# EAGLE design intervalometer (EAGLE 5.09)
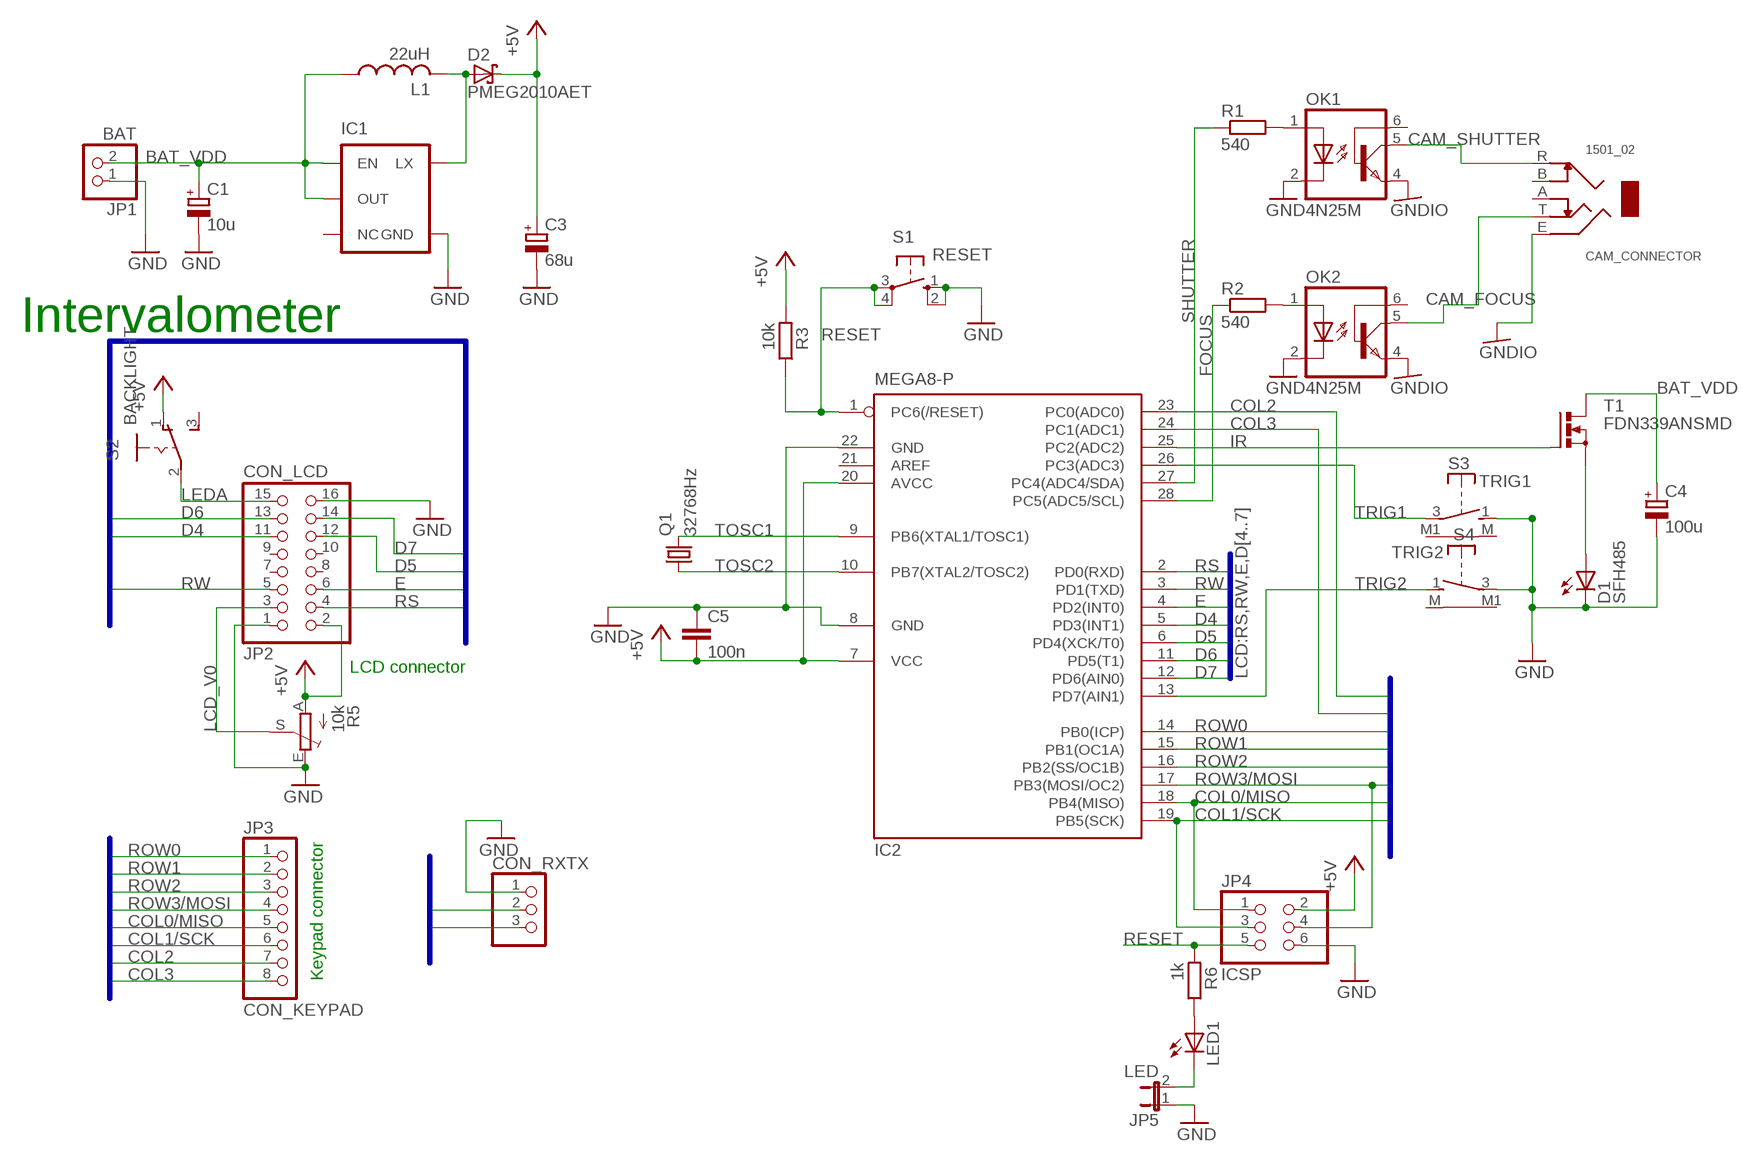
[diagram p0: schematic, sheet 1]

## Parts
C1  10u  CPOL-EUE2-5  [E2-5]
C3  68u  CPOL-EUE2-5  [E2-5]
C4  100u  CPOL-EUE2-5  [E2-5]
C5  100n  C-EU050-024X044  [C050-024X044]
CAM_CONNECTOR  1501_02  [1501_02]
CON_RXTX  PINHD-1X3  [1X03]
D1  SFH485  SFH482  [SFH482]
D2  PMEG2010AET  BAS40  [SOT23]
IC1  V_REG_NCP1400SOT23-5  [SOT23-5]
IC2  MEGA8-P  [DIL28-3]
JP1  BAT  PINHD-1X2  [1X02]
JP2  CON_LCD  PINHD-2X8  [2X08]
JP3  CON_KEYPAD  PINHD-1X8  [1X08]
JP4  ICSP  PINHD-2X3  [2X03]
JP5  LED  JP1E  [JP1]
L1  22uH  L-USL4035M  [L4035M]
LED1  LED3MM  [LED3MM]
OK1  4N25M  [DIL06]
OK2  4N25M  [DIL06]
Q1  32768Hz  CRYSTALTC26V  [TC26V]
R1  540  R-EU_0207/10  [0207/10]
R2  540  R-EU_0207/10  [0207/10]
R3  10k  R-EU_0207/10  [0207/10]
R5  10k  TRIM_EU-B25P  [B25P]
R6  1k  R-EU_0207/10  [0207/10]
S1  RESET  10-XX  [B3F-10XX]
S2  BACKLIGHT  255SB  [255SB]
S3  TRIG1  TP33W  [TP33W]
S4  TRIG2  TP33W  [TP33W]
T1  FDN339ANSMD  [SUPERSOT-3]

## Nets
+5V [power]: C3.+ C5.2 D2.3(C) IC2.7(VCC) IC2.20(AVCC) JP2.2 JP4.2 R3.2 R5.A S2.1(O)
BAT_VDD [power]: C1.+ C4.+ IC1.1(EN) IC1.2(OUT) JP1.2 L1.1 T1.D
CAM_FOCUS: CAM_CONNECTOR.T OK2.5(COL)
CAM_SHUTTER: CAM_CONNECTOR.R OK1.5(COL)
COL0/MISO: IC2.18(PB4(MISO)) JP3.5 JP4.1
COL1/SCK: IC2.19(PB5(SCK)) JP3.6 JP4.3
COL2: IC2.23(PC0(ADC0)) JP3.7
COL3: IC2.24(PC1(ADC1)) JP3.8
D4: IC2.5(PD3(INT1)) JP2.11
D5: IC2.6(PD4(XCK/T0)) JP2.12
D6: IC2.11(PD5(T1)) JP2.13
D7: IC2.12(PD6(AIN0)) JP2.14
E: IC2.4(PD2(INT0)) JP2.6
FOCUS: IC2.28(PC5(ADC5/SCL)) R2.1
GND [gnd]: C1.- C3.- C4.- C5.1 CON_RXTX.1 D1.K(C) IC2.8(GND) IC2.22(GND) JP1.1 JP2.1 JP2.16 JP4.6 JP5.1 OK1.2(C) OK2.2(C) R5.E S1.1(S) S1.2(S1) S3.1(S) S4.3(P)
GNDIO: CAM_CONNECTOR.E OK1.4(EMI) OK2.4(EMI)
IR: IC2.25(PC2(ADC2)) T1.G
LCD_V0: JP2.3 R5.S
LEDA: JP2.15 S2.2(P)
N$1: JP5.2 LED1.K(C)
N$2: LED1.A R6.1
N$3: OK1.1(A) R1.2
N$4: OK2.1(A) R2.2
N$7: D1.A T1.S
N$32: D2.1(A) IC1.5(LX) L1.2
RESET: IC2.1(PC6(/RESET)) JP4.5 R3.1 R6.2 S1.3(P) S1.4(P1)
ROW0: IC2.14(PB0(ICP)) JP3.1
ROW1: IC2.15(PB1(OC1A)) JP3.2
ROW2: IC2.16(PB2(SS/OC1B)) JP3.3
ROW3/MOSI: IC2.17(PB3(MOSI/OC2)) JP3.4 JP4.4
RS: CON_RXTX.2 IC2.2(PD0(RXD)) JP2.4
RW: CON_RXTX.3 IC2.3(PD1(TXD)) JP2.5
SHUTTER: IC2.27(PC4(ADC4/SDA)) R1.1
TOSC1: IC2.9(PB6(XTAL1/TOSC1)) Q1.2
TOSC2: IC2.10(PB7(XTAL2/TOSC2)) Q1.1
TRIG1: IC2.26(PC3(ADC3)) S3.3(P)
TRIG2: IC2.13(PD7(AIN1)) S4.1(S)
Unconnected: CAM_CONNECTOR.A CAM_CONNECTOR.B IC1.3(NC) IC1.4(GND) IC2.21(AREF) JP2.7 JP2.8 JP2.9 JP2.10 OK1.6(BAS) OK2.6(BAS) S2.3(S) S3.M S3.M1(M) S4.M S4.M1(M)

## Buses
LCD:RS,RW,E,D[4..7]
KEYPAD:ROW[0..2],ROW3/MOSI,COL0/MISO,COL1/SCK,COL2,COL3

## Notes on the sheet
- Intervalometer
- LCD connector
- Keypad connector

## Library data of the parts
C1 C3 C4 = rcl:CPOL-EU: POLARIZED CAPACITOR, European symbol
C5 = rcl:C-EU: CAPACITOR, European symbol
CAM_CONNECTOR = DIY:1501_02: Lumber 1501_02 SMT mountebalre stereo 2.5mm jack connector with two breaks
CON_RXTX = pinhead:PINHD-1X3: PIN HEADER
D1 = led:SFH482: IR LED infrared emitting diode, Infineon
D2 = diode:BAS40: Silicon Schottky Diodes General-purpose diode for high-speed switching
IC1 = SparkFun:V_REG_NCP1400: Switching step-up voltage regulator NCP1400 switiching regulator takes single cell AA and outputs 100mA at 3.3V or 5V with minimal number of external components.
IC2 = atmel:MEGA8-P: MICROCONTROLLER 8 Kbytes FLASH, 1 kbytes SRAM, 512 bytes EEPROM, USART, 4-channel 10 bit ADC, 2-channel 8 bit ADC Pin compatible with Atmega48, ATMega88, ATMega168 Source: avr.lbr
JP1 = pinhead:PINHD-1X2: PIN HEADER
JP2 = pinhead:PINHD-2X8: PIN HEADER
JP3 = pinhead:PINHD-1X8: PIN HEADER
JP4 = pinhead:PINHD-2X3: PIN HEADER
JP5 = jumper:JP1E: JUMPER
L1 = rcl:L-US: INDUCTOR, American symbol
LED1 = led:LED: LED OSRAM: - CHIPLED LG R971, LG N971, LY N971, LG Q971, LY Q971, LO R971, LY R971 LH N974, LH R974 LS Q976, LO Q976, LY Q976 LO Q996 - Hyper CHIPLED LW Q18S LB Q993, LB Q99A, LB R99A - SideLED LS A670, LO A670, LY A670, LG A670, LP A670 LB A673, LV A673, LT A673, LW A673 LH A674 LY A675 LS A676, LA A676, LO A676, LY A676, LW A676 LS A679, LY A679, LG A679 - Hyper Micro SIDELED® LS Y876, LA Y876, LO Y876, LY Y876 LT Y87S - SmartLED LW L88C, LW L88S LB L89C, LB L89S, LG L890 LS L89K, LO L89K, LY L89K LS L896, LA L896, LO L896, LY L896 - TOPLED LS T670, LO T670, LY T670, LG T670, LP T670 LSG T670, LSP T670, LSY T670, LOP T670, LYG T670 LG T671, LOG T671, LSG T671 LB T673, LV T673, LT T673, LW T673 LH T674 LS T676, LA T676, LO T676, LY T676, LB T676, LH T676, LSB T676, LW T676 LB T67C, LV T67C, LT T67C, LS T67K, LO T67K, LY T67K, LW E67C LS E67B, LA E67B, LO E67B, LY E67B, LB E67C, LV E67C, LT E67C LW T67C LS T679, LY T679, LG T679 LS T770, LO T770, LY T770, LG T770, LP T770 LB T773, LV T773, LT T773, LW T773 LH T774 LS E675, LA E675, LY E675, LS T675 LS T776, LA T776, LO T776, LY T776, LB T776 LHGB T686 LT T68C, LB T68C - Hyper Mini TOPLED® LB M676 - Mini TOPLED Santana® LG M470 LS M47K, LO M47K, LY M47K Source: http://www.osram.convergy.de LUXEON: - LUMILED® LXK2-PW12-R00, LXK2-PW12-S00, LXK2-PW14-U00, LXK2-PW14-V00 LXK2-PM12-R00, LXK2-PM12-S00, LXK2-PM14-U00 LXK2-PE12-Q00, LXK2-PE12-R00, LXK2-PE12-S00, LXK2-PE14-T00, LXK2-PE14-U00 LXK2-PB12-K00, LXK2-PB12-L00, LXK2-PB12-M00, LXK2-PB14-N00, LXK2-PB14-P00, LXK2-PB14-Q00 LXK2-PR12-L00, LXK2-PR12-M00, LXK2-PR14-Q00, LXK2-PR14-R00 LXK2-PD12-Q00, LXK2-PD12-R00, LXK2-PD12-S00 LXK2-PH12-R00, LXK2-PH12-S00 LXK2-PL12-P00, LXK2-PL12-Q00, LXK2-PL12-R00 Source: www.luxeon.com KINGBRIGHT: KA-3528ASYC Source: www.kingbright.com
OK1 OK2 = optocoupler:4N*?M: General Purpose 6-Pin Phototransistor Optocouplers Source: http://www.fairchildsemi.com/ds/4N/4N35-M.pdf
Q1 = crystal:CRYSTAL: CRYSTAL
R1-R3 R6 = rcl:R-EU_: RESISTOR, European symbol
R5 = pot:TRIM_EU-: POTENTIOMETER
S1 = switch-omron:10-XX: OMRON SWITCH
S2 = switch:255SB: SLIDING SWITCH Distributor Buerklin, 11G810
S3 S4 = switch-misc:TP33W: SWITCH
T1 = DIY:FDN339AN: N-Channel 2.5V Specified PowerTrench? MOSFET

## Net classes
0 default: width 0.254 mm, drill 0.305 mm, clearance 0.152 mm
1 power: width 0.61 mm, drill 0.508 mm, clearance 0.152 mm
2 gnd: width 0.305 mm, drill 0.508 mm, clearance 0.152 mm
3 usbvcc: width 0.508 mm, drill 0.508 mm, clearance 0.152 mm
4 aref: width 0.406 mm

## Board
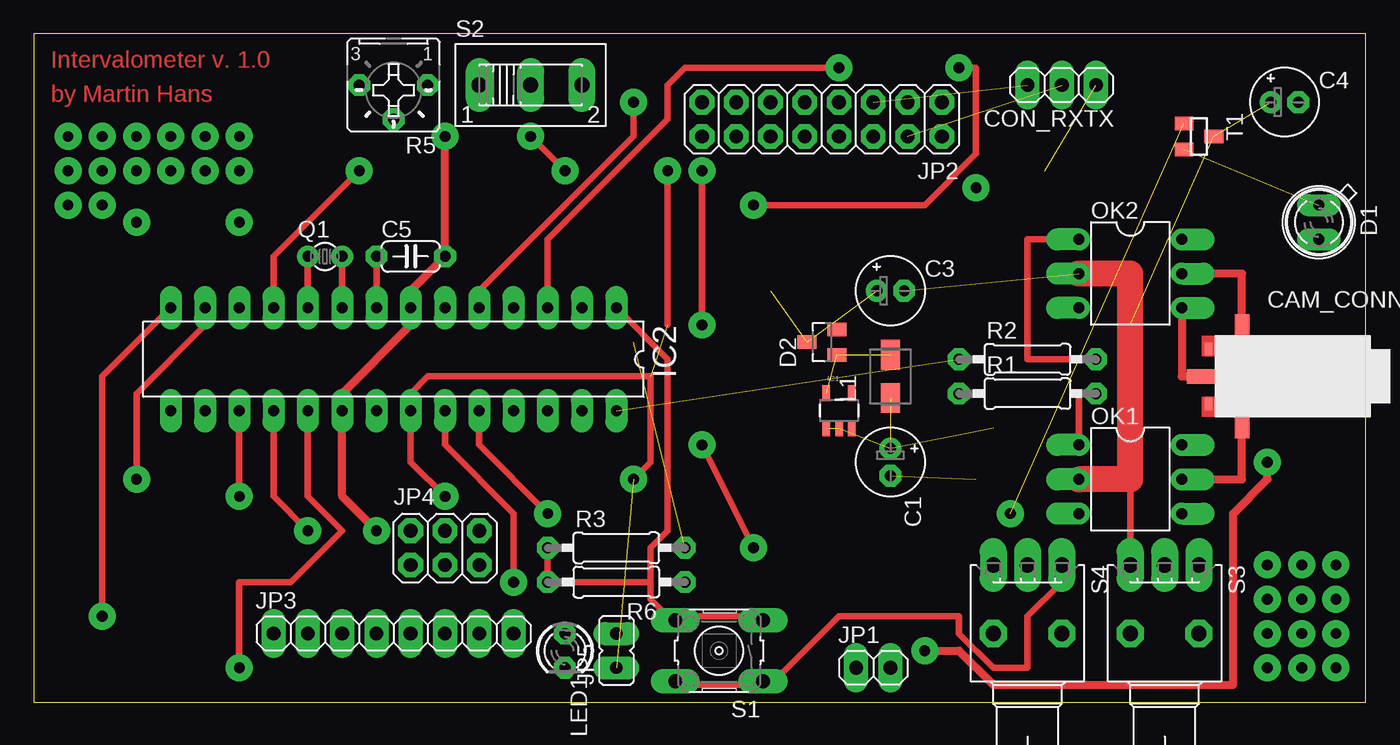
[diagram p1: board, top side]
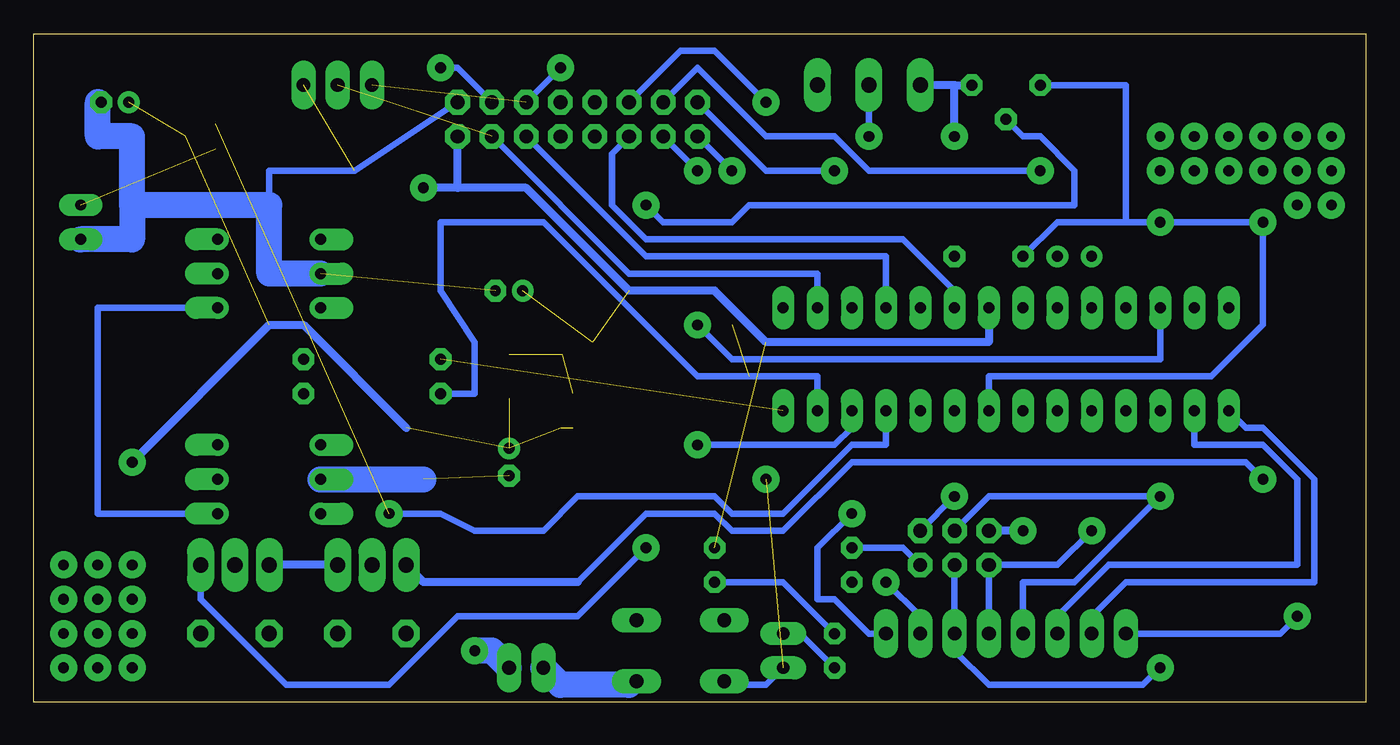
[diagram p2: board, bottom side, seen from below]

Size 98.73 x 49.52 mm. Coordinates in mm from the lower left corner, seen from the top.
Outline: 0,0 98.73,0 98.73,49.52 0,49.52 0,0
Copper layers (1*16): Top 0.035mm / dielectric 1.5mm / Bottom 0.035mm
Design rules "hobby *": minimum track width 0.5mm, minimum drill 0.8mm, track to track 0.3mm, track to pad 0.5mm, pad to pad 0.4mm, via to via 0.5mm, smd to smd 8mil, copper to edge 10mil, drill to drill 8mil, minimum pad ring 0.4mm, minimum via ring 0.6mm, stop-mask expansion 0mil, vias tented up to drill 0mil, thermal gap 10mil
tRestrict: area 41.9,1.3 to 44.5,6.3; area 59.7,1.3 to 64.8,3.8; area 16.5,3.8 to 36.8,6.3; area 48.3,40.6 to 68.6,45.7; area 92.7,33 to 97.8,38.1; area 26.7,8.9 to 34.3,14; area 38.1,1.3 to 40.6,6.3; area 31.8,43.2 to 41.9,48.3; area 22.9,43.2 to 30.5,49.5; area 61,14 to 66,16.5; area 90.2,43.2 to 95.2,45.7
vRestrict: area 7.6,22.9 to 45.7,27.9; area 39.4,10.2 to 47,12.7; area 39.4,7.6 to 47,10.2; area 69.8,24.1 to 77.5,26.7; area 69.8,21.6 to 77.5,24.1; area 78.7,27.9 to 83.8,35.6; area 78.7,12.7 to 83.8,20.3; area 69.8,1.3 to 87.6,8.9; area 87.6,21.6 to 99.1,26.7

### Footprints (pad centres in the part's own frame; a part is rotated, then mirrored left to right if it is on the bottom)
E2-5 = drill 0.813 pad 1.27 round: + -1.016,0 | drill 0.813 pad 1.27 octagon: - 1.016,0
C050-024X044 = drill 0.813 octagon: 1 -2.54,0; 2 2.54,0
1501_02 = smd 1.016 x 0.508: A -2,-12; B 2,-12 | smd 1.067 x 2.184: E 0,-12.5 | smd 2.184 x 1.067: R 3.5,-9.5; T -3.5,-9.5
1X03 = drill 1.016 long: 1 -2.54,0; 2 0,0; 3 2.54,0
SFH482 = drill 0.813 long: A -1.27,0; K 1.27,0
SOT23 = smd 1 x 1.4: 1 -0.95,-1.1; 2 0.95,-1.1; 3 0,1.1
SOT23-5 = smd 0.55 x 1.2: 1 -0.95,-1.3; 2 0,-1.3; 3 0.95,-1.3; 4 0.95,1.3; 5 -0.95,1.3
DIL28-3 = drill 0.813 long: 1 -16.51,-3.81; 2 -13.97,-3.81; 3 -11.43,-3.81; 4 -8.89,-3.81; 5 -6.35,-3.81; 6 -3.81,-3.81; 7 -1.27,-3.81; 8 1.27,-3.81; 9 3.81,-3.81; 10 6.35,-3.81; 11 8.89,-3.81; 12 11.43,-3.81; 13 13.97,-3.81; 14 16.51,-3.81; 15 16.51,3.81; 16 13.97,3.81; 17 11.43,3.81; 18 8.89,3.81; 19 6.35,3.81; 20 3.81,3.81; 21 1.27,3.81; 22 -1.27,3.81; 23 -3.81,3.81; 24 -6.35,3.81; 25 -8.89,3.81; 26 -11.43,3.81; 27 -13.97,3.81; 28 -16.51,3.81
1X02 = drill 1.016 long: 1 -1.27,0; 2 1.27,0
2X08 = drill 1.016 octagon: 1 -8.89,-1.27; 2 -8.89,1.27; 3 -6.35,-1.27; 4 -6.35,1.27; 5 -3.81,-1.27; 6 -3.81,1.27; 7 -1.27,-1.27; 8 -1.27,1.27; 9 1.27,-1.27; 10 1.27,1.27; 11 3.81,-1.27; 12 3.81,1.27; 13 6.35,-1.27; 14 6.35,1.27; 15 8.89,-1.27; 16 8.89,1.27
1X08 = drill 1.016 long: 1 -8.89,0; 2 -6.35,0; 3 -3.81,0; 4 -1.27,0; 5 1.27,0; 6 3.81,0; 7 6.35,0; 8 8.89,0
2X03 = drill 1.016 octagon: 1 -2.54,-1.27; 2 -2.54,1.27; 3 0,-1.27; 4 0,1.27; 5 2.54,-1.27; 6 2.54,1.27
JP1 = drill 0.914 long: 1 0,-1.27; 2 0,1.27
L4035M = smd 2.2 x 1.4: 1 -1.6,0; 2 1.6,0
LED3MM = drill 0.813 octagon: A -1.27,0; K 1.27,0
DIL06 = drill 0.813 offset: 1 -2.54,-3.81; 2 0,-3.81; 3 2.54,-3.81; 4 2.54,3.81; 5 0,3.81; 6 -2.54,3.81
TC26V = drill 0.813 round: 1 -1.27,0; 2 1.27,0
0207/10 = drill 0.813 octagon: 1 -5.08,0; 2 5.08,0
B25P = drill 0.813 octagon: A -2.54,0; E 2.54,0; S 0,2.54
B3F-10XX = drill 1.016 long: 1 -3.251,2.261; 2 3.251,2.261; 3 -3.251,-2.261; 4 3.251,-2.261
255SB = drill 1.118 long: 1 -3.81,0; 2 0,0; 3 3.81,0
TP33W = drill 1.118 long: 1 2.54,-5.08; 2 0,-5.08; 3 -2.54,-5.08 | drill 1.118 octagon: M 2.54,0; M1 -2.54,0
SUPERSOT-3 = smd 1 x 1.4: D 0,1.1; G -0.95,-1.1; S 0.95,-1.1

### Placement (x,y rotation side)
C1  63.5,17.78 270 top
C3  63.5,30.48 0 top
C4  92.71,44.45 0 top
C5  27.94,33.02 0 top
CAM_CONNECTOR  99.06,24.13 270 top
CON_RXTX  76.2,45.72 180 top
D1  95.25,35.56 270 top
D2  58.42,26.67 90 top
IC1  59.69,21.59 0 top
IC2  26.67,25.4 180 top
JP1  62.23,2.54 0 top
JP2  58.42,43.18 180 top
JP3  26.67,5.08 0 top
JP4  30.48,11.43 0 top
JP5  43.18,3.81 0 top
L1  63.5,24.13 90 top
LED1  39.37,3.81 270 top
OK1  81.28,16.51 270 top
OK2  81.28,31.75 270 top
Q1  21.59,33.02 0 top
R1  73.66,22.86 0 top
R2  73.66,25.4 0 top
R3  43.18,11.43 0 top
R5  26.67,45.72 180 top
R6  43.18,8.89 180 top
S1  50.8,3.81 180 top
S2  36.83,45.72 0 top
S3  83.82,5.08 180 top
S4  73.66,5.08 180 top
T1  86.36,41.91 270 top

### Tracks (layer width: path | path; a pad name or v marks a point on that pad's centre or on a via)
+5V  (via drill 0.8)  (3 unrouted)
  Top 0.61: v25.4,12.7 22.86,15.24 IC2.20 22.86,22.86 27.94,27.94 IC2.7 27.94,30.48 C5.2 v30.48,41.91
  Bottom 0.61: 30.48,45.72 S2.1 | 30.48,45.72 R5.A | v25.4,12.7 JP4.2 | v30.48,41.91 30.48,45.72 | 67.31,38.1 JP2.2 | 67.31,38.1 v69.85,38.1 | IC2.7 27.94,26.67 44.45,26.67 48.26,30.48 54.61,30.48 62.23,38.1 67.31,38.1
BAT_VDD  (via drill 0.8)  (6 unrouted)
  Top 0.61: v66.04,3.81 68.58,3.81 71.12,1.27 88.9,1.27 88.9,13.97 91.44,16.51 v91.44,17.78
  Bottom 0.61: 71.12,20.32 78.74,27.94 81.28,27.94 v91.44,17.78
  Bottom 1.93: JP1.2 64.77,3.81 v66.04,3.81
CAM_FOCUS
  Top 0.61: OK2.5 89.56,31.75 CAM_CONNECTOR.T
CAM_SHUTTER
  Top 0.61: OK1.5 89.56,16.51 CAM_CONNECTOR.R
COL0/MISO  (via drill 0.8)
  Top 0.5: IC2.18 17.78,15.24 v20.32,12.7
  Bottom 0.5: v20.32,12.7 22.86,10.16 JP4.1 JP3.5
COL1/SCK  (via drill 0.8)
  Top 0.5: IC2.19 20.32,15.24 22.86,12.7 19.05,8.89 15.24,8.89 v15.24,2.54
  Bottom 0.5: v15.24,2.54 16.51,1.27 27.94,1.27 30.48,3.81 JP3.6 JP4.3
COL2  (via drill 0.8)
  Top 0.5: IC2.23 30.48,19.05 35.56,13.97 v35.56,8.89
  Bottom 0.5: v35.56,8.89 33.02,6.35 JP3.7
COL3  (via drill 0.8)
  Top 0.5: IC2.24 33.02,19.05 v38.1,13.97
  Bottom 0.5: v38.1,13.97 40.64,11.43 40.64,7.62 39.37,7.62 36.83,5.08 JP3.8
D4  (via drill 0.8)
  Top 0.5: IC2.5 33.02,30.48 44.45,41.91 v44.45,44.45
  Bottom 0.5: v44.45,44.45 48.26,48.26 50.8,48.26 JP2.11
D5
  Bottom 0.5: IC2.6 30.48,30.48 34.29,34.29 53.34,34.29 55.88,36.83 55.88,40.64 JP2.12
D6  (via drill 0.8)
  Top 0.5: IC2.11 17.78,33.02 v24.13,39.37
  Bottom 0.5: v24.13,39.37 36.83,39.37 39.37,41.91 44.45,41.91 49.53,46.99 JP2.13
D7  (via drill 0.8)
  Top 0.5: v49.53,27.94 v49.53,39.37
  Bottom 0.5: IC2.12 15.24,25.4 46.99,25.4 v49.53,27.94 | v49.53,39.37 JP2.14
E
  Bottom 0.5: IC2.4 35.56,33.02 53.34,33.02 JP2.6
FOCUS  (1 unrouted)
GND  (via drill 0.8)  (5 unrouted)
  Top 0.5: S3.1 81.28,16.51 | C5.1 IC2.8 | v30.48,15.24 27.94,17.78 IC2.22 27.94,22.86 29.21,24.13 45.72,24.13 45.72,17.78 v44.45,16.51 | S1.2 48.26,1.27 53.34,1.27 S1.1 54.61,1.27 59.69,6.35 68.58,6.35 68.58,5.08 71.12,2.54 73.66,2.54 73.66,6.35 76.2,8.89 S4.3 | 46.99,27.94 v46.99,39.37
  Top 1.93: OK1.2 81.28,16.51 81.28,31.75 OK2.2
  Bottom 0.5: 93.98,44.45 C4.- | JP2.1 74.93,39.37 81.28,39.37 81.28,36.83 | IC2.22 27.94,24.13 11.43,24.13 7.62,27.94 v7.62,35.56 v15.24,35.56 17.78,35.56 | 17.78,35.56 17.78,45.72 R5.E | v30.48,15.24 JP4.6 | C5.1 22.86,35.56 17.78,35.56 | JP5.1 44.45,1.27 46.99,1.27 S1.2 | S1.1 54.61,1.27 | v46.99,39.37 JP2.16
  Bottom 0.61: S4.3 S3.1
  Bottom 1.93: 91.44,36.83 81.28,36.83 81.28,31.75 OK2.2 | 91.44,36.83 91.44,34.29 D1.K | 93.98,44.45 93.98,41.91 91.44,41.91 91.44,36.83 | JP1.1 59.69,1.27 54.61,1.27 | OK1.2 69.85,16.51
GNDIO
  Top 0.61: OK2.4 85.09,24.13 CAM_CONNECTOR.E
  Bottom 0.5: OK1.4 93.98,13.97 93.98,29.21 OK2.4
IR  (via drill 0.8)  (1 unrouted)
  Bottom 0.5: IC2.25 35.56,19.05 38.1,19.05 43.18,13.97 46.99,13.97 48.26,15.24 58.42,15.24 60.96,12.7 66.04,12.7 68.58,13.97 v72.39,13.97
LCD_V0  (via drill 0.8)
  Top 0.5: v53.34,36.83 66.04,36.83 69.85,40.64 69.85,46.99 v68.58,46.99
  Bottom 0.5: R5.S 25.4,41.91 24.13,41.91 21.59,39.37 21.59,36.83 45.72,36.83 46.99,35.56 52.07,35.56 v53.34,36.83 | v68.58,46.99 67.31,46.99 JP2.3
LEDA  (via drill 0.8)
  Top 0.5: v36.83,41.91 v39.37,39.37
  Bottom 0.5: JP2.15 44.45,39.37 v39.37,39.37 | v36.83,41.91 S2.2
N$1
  Bottom 0.5: LED1.K 41.91,5.08 JP5.2
N$2
  Bottom 0.5: LED1.A 43.18,8.89 R6.1
N$3
  Top 0.5: OK1.1 77.47,22.86 R1.2
N$4
  Top 0.5: R2.2 73.66,25.4 73.66,34.29 OK2.1
N$5  (via drill 0.8)
  other vias: 91.44,10.16
N$6  (via drill 0.8)
  other vias: 93.98,10.16
N$7  (1 unrouted)
N$8  (via drill 0.8)
  other vias: 96.52,10.16
N$9  (via drill 0.8)
  other vias: 96.52,7.62
N$10  (via drill 0.8)
  other vias: 93.98,7.62
N$11  (via drill 0.8)
  other vias: 91.44,7.62
N$12  (via drill 0.8)
  other vias: 91.44,5.08
N$13  (via drill 0.8)
  other vias: 93.98,5.08
N$14  (via drill 0.8)
  other vias: 96.52,5.08
N$15  (via drill 0.8)
  other vias: 96.52,2.54
N$16  (via drill 0.8)
  other vias: 93.98,2.54
N$17  (via drill 0.8)
  other vias: 91.44,2.54
N$18  (via drill 0.8)
  other vias: 2.54,41.91
N$19  (via drill 0.8)
  other vias: 5.08,41.91
N$20  (via drill 0.8)
  other vias: 7.62,41.91
N$21  (via drill 0.8)
  other vias: 10.16,41.91
N$22  (via drill 0.8)
  other vias: 12.7,41.91
N$23  (via drill 0.8)
  other vias: 15.24,41.91
N$24  (via drill 0.8)
  other vias: 15.24,39.37
N$25  (via drill 0.8)
  other vias: 12.7,39.37
N$26  (via drill 0.8)
  other vias: 10.16,39.37
N$27  (via drill 0.8)
  other vias: 7.62,39.37
N$28  (via drill 0.8)
  other vias: 5.08,39.37
N$29  (via drill 0.8)
  other vias: 2.54,39.37
N$30  (via drill 0.8)
  other vias: 2.54,36.83
N$31  (via drill 0.8)
  other vias: 5.08,36.83
N$32  (2 unrouted)
RESET
  Top 0.5: R3.1 R6.2 45.72,8.89 | IC2.1 46.99,25.4 46.99,12.7 45.72,11.43 45.72,8.89 | 45.72,8.89 45.72,7.62 46.99,6.35 S1.4 48.26,6.35 53.34,6.35 S1.3
  Bottom 0.5: JP4.5 34.29,11.43 R3.1
ROW0  (via drill 0.8)
  Top 0.5: IC2.14 5.08,24.13 v5.08,6.35
  Bottom 0.5: v5.08,6.35 6.35,5.08 JP3.1
ROW1
  Bottom 0.5: IC2.15 8.89,20.32 7.62,20.32 3.81,16.51 3.81,8.89 17.78,8.89 20.32,6.35 JP3.2
ROW2
  Bottom 0.5: IC2.16 12.7,19.05 7.62,19.05 5.08,16.51 5.08,10.16 19.05,10.16 22.86,6.35 JP3.3
ROW3/MOSI  (via drill 0.8)
  Top 0.5: v15.24,15.24 IC2.17
  Bottom 0.5: JP4.4 27.94,15.24 v15.24,15.24 21.59,8.89 25.4,8.89 JP3.4
RS  (1 unrouted)
  Bottom 0.5: IC2.2 40.64,31.75 54.61,31.75 JP2.4
RW  (via drill 0.8)  (1 unrouted)
  Top 0.5: IC2.3 38.1,34.29 46.99,43.18 46.99,45.72 48.26,46.99 v59.69,46.99
  Bottom 0.5: v59.69,46.99 JP2.5
SHUTTER
  Bottom 0.5: IC2.27 40.64,24.13 49.53,24.13 60.96,35.56 68.58,35.56 68.58,30.48 66.04,26.67 66.04,22.86 R1.1
TOSC1
  Top 0.5: IC2.9 Q1.2
TOSC2
  Top 0.5: IC2.10 Q1.1
TRIG1  (via drill 0.8)
  Top 0.5: v49.53,19.05 v53.34,11.43
  Bottom 0.5: IC2.26 38.1,20.32 39.37,19.05 v49.53,19.05 | v53.34,11.43 58.42,6.35 67.31,6.35 72.39,1.27 80.01,1.27 86.36,7.62 S3.3
TRIG2  (via drill 0.8)
  Top 0.5: IC2.13 12.7,27.94 7.62,22.86 v7.62,16.51
  Bottom 0.5: v7.62,16.51 8.89,17.78 38.1,17.78 43.18,12.7 46.99,12.7 48.26,13.97 53.34,13.97 58.42,8.89
  Bottom 0.61: 58.42,8.89 69.85,8.89 S4.1
(copper drawn outside any net)
  shapes: Bottom area x4, Top area x4

### Text on the board
Top: Intervalometer v. 1.0 | by Martin Hans